# Altium schematic sheet Control Units.SchDoc
size A3
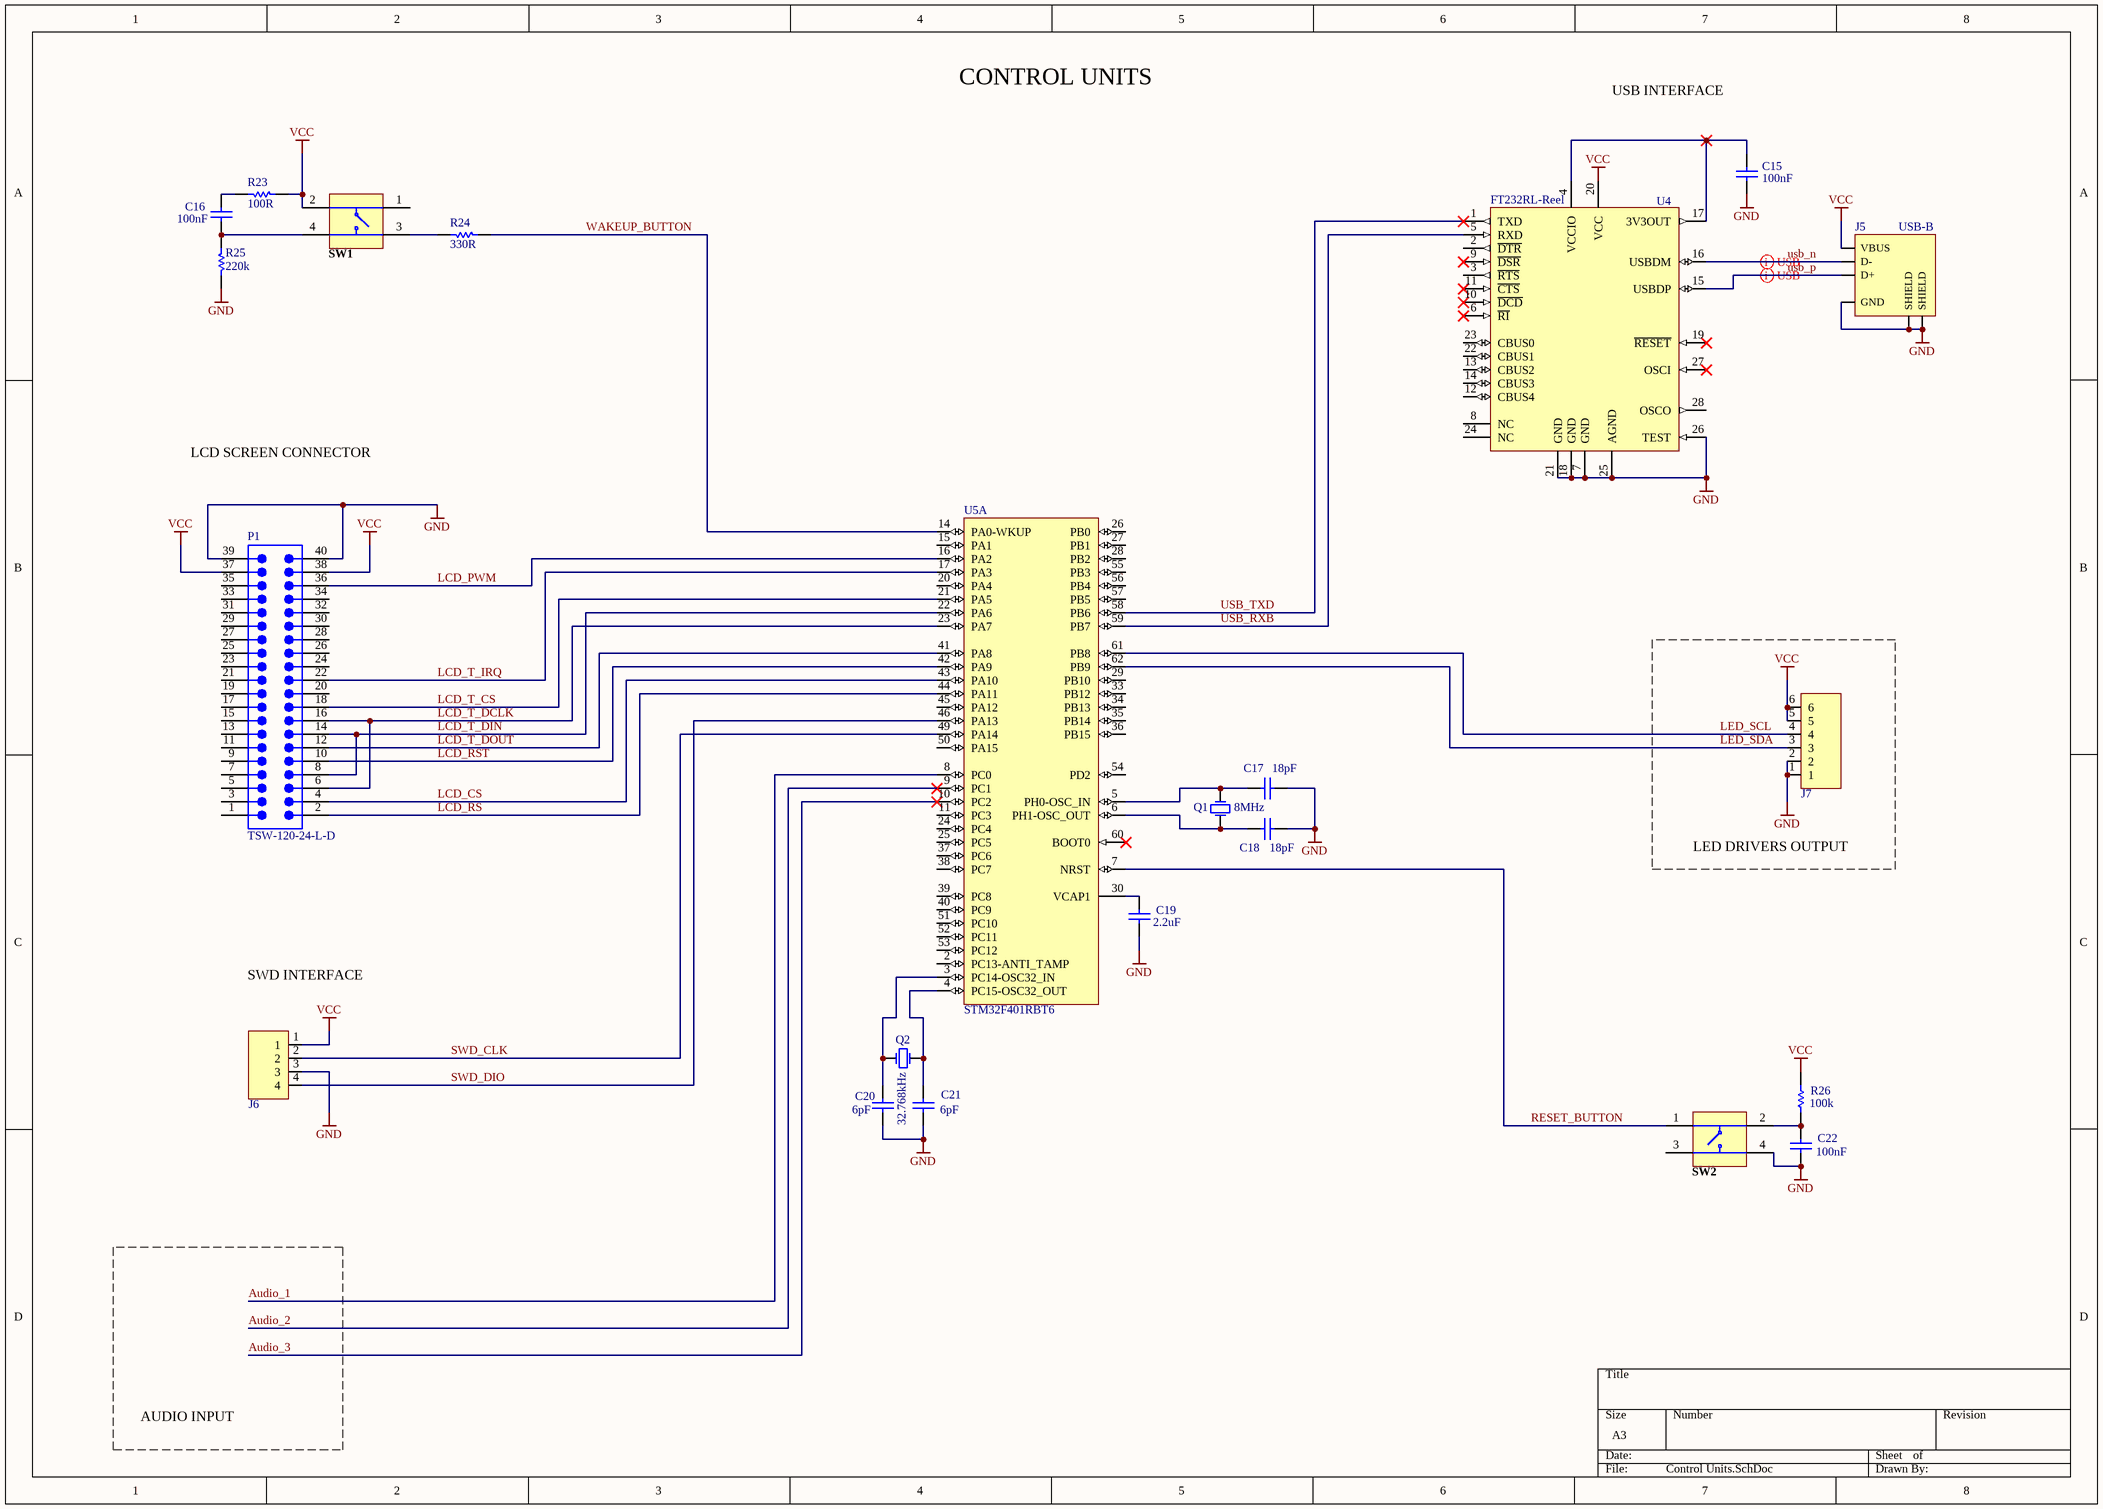
[diagram p0: Control Units.SchDoc]

## Parts
C15  value 100nF  [CAPC0603(1608)100_N]  (hidden comment: CAP 100nF 25V 0603(1608))
C16  value 100nF  [CAPC0603(1608)100_N]  (hidden comment: CAP 100nF 25V 0603(1608))
C17  value 18pF  [CAPC0603(1608)100_L]  (hidden comment: CAP 18pF 200V 0603(1608))
C18  value 18pF  [CAPC0603(1608)100_L]  (hidden comment: CAP 18pF 200V 0603(1608))
C19  value 2.2uF  [CAPC0603(1608)100_M]  (hidden comment: CAP 2.2uF 25V 0603(1608))
C20  value 6pF  [CAPC0603(1608)100_L]  (hidden comment: CAP 6pF 50V 0603(1608))
C21  value 6pF  [CAPC0603(1608)100_L]  (hidden comment: CAP 6pF 50V 0603(1608))
C22  value 100nF  [CAPC0603(1608)100_N]  (hidden comment: CAP 100nF 25V 0603(1608))
J5  USB-B  [UBS B]
J6  (no value)  [J_THT_HDR_1x4_R2.54-V]
J7  DS1021-1*40SF11  [J_THT_HDR_1x6_R2.54-V]  (value not drawn)
P1  TSW-120-24-L-D  [SMTC-TSW-120-24-X-D]
Q1  8MHz  [HC49SM]
Q2  32.768kHz  [PKG_CFPX-217]
R23  value 100R  [RESC0603(1608)_M]  (hidden comment: 100R 1% 0603(1608))
R24  value 330R  [RESC0603(1608)_L]  (hidden comment: 330R 1% 0603(1608))
R25  value 220k  [RESC0603(1608)_L]  (hidden comment: 220K 1% 0603(1608))
R26  value 100k  [RESC0603(1608)_N]  (hidden comment: 100K 5% 0603(1608))
SW1  TVCM01-038B  [JNFU-TVCM01-038B_V]  (value not drawn)
SW2  TVCM01-038B  [JNFU-TVCM01-038B_V]  (value not drawn)
U4  FT232RL-Reel  [SSOP-28_L]
U5  STM32F401RBT6  [STM-LQFP64_N]  (part A of 2)

## Blocks framed on the sheet
LED DRIVERS OUTPUT: J7

## Nets
GND: C15.2 C17.1 C18.1 C19.1 C20.2 C21.1 C22.2 J5.4(GND) J5.5(SHIELD) J5.6(SHIELD) J6.3 J7.1 J7.2 P1.39 P1.40 R25.1 SW2.4 U4.7(GND) U4.18(GND) U4.21(GND) U4.25(AGND) U4.26(TEST)
VCC: J5.1(VBUS) J6.1 J7.5 J7.6 P1.37 P1.38 R23.2 R26.2 SW1.2 U4.20(VCC)
Audio_1: U5.8(PC0)
Audio_2: U5.9(PC1)
Audio_3: U5.10(PC2)
LCD_CS: P1.4 U5.43(PA10)
LCD_PWM: P1.36 U5.16(PA2)
LCD_RS: P1.2 U5.44(PA11)
LCD_RST: P1.10 U5.42(PA9)
LCD_T_CS: P1.18 U5.21(PA5)
LCD_T_DCLK: P1.6 P1.16 U5.23(PA7)
LCD_T_DIN: P1.8 P1.14 U5.22(PA6)
LCD_T_DOUT: P1.12 U5.41(PA8)
LCD_T_IRQ: P1.22 U5.17(PA3)
LED_SCL: J7.4 U5.61(PB8)
LED_SDA: J7.3 U5.62(PB9)
RESET_BUTTON: SW2.1 U5.7(NRST)
SWD_CLK: J6.2 U5.49(PA14)
SWD_DIO: J6.4 U5.46(PA13)
usb_n: J5.3(D-) U4.16(USBDM)
usb_p: J5.2(D+) U4.15(USBDP)
USB_RXB: U4.5(RXD) U5.59(PB7)
USB_TXD: U4.1(TXD) U5.58(PB6)
WAKEUP_BUTTON: R24.1 U5.14(PA0-WKUP)
NetC15_1: C15.1 U4.4(VCCIO) U4.17(3V3OUT)
NetC16_1: C16.1 R23.1
NetC16_2: C16.2 R25.2 SW1.4
NetC17_2: C17.2 Q1.2(OSC2) U5.5(PH0-OSC_IN)
NetC18_2: C18.2 Q1.1(OSC1) U5.6(PH1-OSC_OUT)
NetC19_2: C19.2 U5.30(VCAP1)
NetC20_1: C20.1 Q2.2(OSC2) U5.3(PC14-OSC32_IN)
NetC21_2: C21.2 Q2.1(OSC1) U5.4(PC15-OSC32_OUT)
NetC22_1: C22.1 R26.1 SW2.2
NetR24_2: R24.2 SW1.3

Not connected (* = marked no-connect by the designer): P1 1 3 5 7 9 11 13 15 17 19 20 21 23 24 25 26 27 28 29 30 31 32 33 34 35; SW1 1; SW2 3; U4 2(~{DTR}) 3(~{RTS}) 6(~{RI})* 8(NC) 9(~{DSR})* 10(~{DCD})* 11(~{CTS})* 12(CBUS4) 13(CBUS2) 14(CBUS3) 19(~{RESET})* 22(CBUS1) 23(CBUS0) 24(NC) 27(OSCI)* 28(OSCO); U5 2(PC13-ANTI_TAMP) 11(PC3) 15(PA1) 20(PA4) 24(PC4) 25(PC5) 26(PB0) 27(PB1) 28(PB2) 29(PB10) 33(PB12) 34(PB13) 35(PB14) 36(PB15) 37(PC6) 38(PC7) 39(PC8) 40(PC9) 45(PA12) 50(PA15) 51(PC10) 52(PC11) 53(PC12) 54(PD2) 55(PB3) 56(PB4) 57(PB5) 60(BOOT0)*

## Layout directives
differential pair: usb_n, usb_p

## Notes on the sheet
- CONTROL UNITS
- USB INTERFACE
- LCD SCREEN CONNECTOR
- SWD INTERFACE
- AUDIO INPUT

## Library data of the parts
C15 C16 C22 = CMP-1035-02589-1: CAP 100nF 25V ±20% 0603 (1608 Metric) Thickness 1mm SMD; Case-EIA: 0603; Tolerance: Â±20%; Case-Metric: 1608; Max Thickness: 1 mm; Technology: SMT; Rated Voltage: 25 V
C17 C18 = CMP-1035-00761-1: CAP 18pF 200V ±5% 0603 (1608 Metric) Thickness 1mm SMD; Tolerance: Â±5%; Case-Metric: 1608; Case-EIA: 0603; Max Thickness: 1 mm; Technology: SMT; Rated Voltage: 200 V
C19 = CMP-1035-02767-1: CAP 2.2uF 25V ±10% 0603 (1608 Metric) Thickness 1mm SMD; Case-EIA: 0603; Tolerance: Â±10%; Case-Metric: 1608; Technology: SMT; Max Thickness: 1 mm; Rated Voltage: 25 V
C20 C21 = CMP-1035-00393-1: CAP 6pF 50V ±0.5pF 0603 (1608 Metric) Thickness 1mm SMD; Case-EIA: 0603; Tolerance: Â±0.5pF; Case-Metric: 1608; Technology: SMT; Max Thickness: 1 mm; Rated Voltage: 50 V
J5 = USB-B: Universal Serial Bus, Type B - 90° Receptacle (TH); Manufacturer: YAMAICHI ELECTRONICS; Component_author: Kajetan Śpionek; Value: USB-B port; HelpURL: http://www.glyn.com/data/glyn/media/doc/USB-B-001-RoHs.pdf; Supplier 1: Farnell; Supplier Part Number 1: 2112373
J6 = J_HDR_1x4: Złącze gold pin
J7 = J_HDR_1x6: Złącze gold pin; EMED_ID: J_HDR_1x6_THT_HDR_1x4_R2.54-V; Producent: CONNFLY; Author_FOOTPRINT: s.szwaczyk@emed.pl; Value: DS1021-1*40SF11; ComponentLink1Description: &Datasheet; ComponentLink1URL: http://www.tme.eu/pl/Document/347cfcc6d022658d2bea6c8b28397055/DS1021.pdf; ComponentLink2Description: &Nota Aplikacyjna; ComponentLink2URL: *; Distributor1: TME; Distributor1_ID: ZL201-40G; Distributor2: *; Distributor2_ID: *; HelpURL: http://www.tme.eu/pl/Document/347cfcc6d022658d2bea6c8b28397055/DS1021.pdf; Type: *; Current_RATED: *; Author_SYMBOL: s.szwaczyk@emed.pl; ESR: *; Power_RATED: *; Producent_ID: DS1021-1*40SF11; Series: *; Temperature_RATED: *; Tolerance: *; Voltage_AC: *; Voltage_DC: *; Voltage_RATED: *
P1 = CMP-1024-00454-1: Manufacturer: Samtec; Pitch: 2.54 mm; ComponentLink1Description: Manufacturer URL; ComponentLink3URL: http://www.samtec.com/documents/webfiles/cpdf/TSW-XXX-XX-XXX-X-XX-XXX-MKT.pdf; PackageVersion: DM, 8/1988; Orientation: Vertical; Mounting Technology: Through-hole; PackageDescription: .025[0.64] SQ. Post Terminal Strip Assembly; Temperature Range: -55 to 125 degC; ComponentLink1URL: http://www.samtec.com; PartNumber: TSW-120-24-L-D; DatasheetVersion: F-214; ComponentLink2URL: http://www.samtec.com/documents/webfiles/pdf/TSW_TH.PDF; ComponentLink3Description: Package Specification; RoHS: True; PackageReference: TSW-120-24-X-D; ComponentLink2Description: Datasheet
Q1 = Q_LFXTAL003151: Kwarc 8MHz, HC49SM; Value: 8MHz
Q2 = Q_CFPX-217: Kwarc 32.768kHz, CFPX-217; Value: 32.768kHz
R23 = CMP-1012-00397-1: 100R 0.1W 1% 0603 (1608 Metric)  SMD; Case-EIA: 0603; Case-Metric: 1608; Technology: SMT; Tolerance: 1 %; Power: 0.1 W
R24 = CMP-1012-00454-1: 330R 0.1W 1% 0603 (1608 Metric)  SMD; Case-Metric: 1608; Case-EIA: 0603; Tolerance: 1 %; Technology: SMT; Power: 0.1 W
R25 = CMP-1012-00772-1: 220K 0.1W 1% 0603 (1608 Metric)  SMD; Case-EIA: 0603; Case-Metric: 1608; Tolerance: 1 %; Technology: SMT; Power: 0.1 W
R26 = CMP-1012-00122-1: 100K 0.1W 5% 0603 (1608 Metric)  SMD; Case-EIA: 0603; Case-Metric: 1608; Tolerance: 5 %; Power: 0.1 W; Technology: SMT
SW1 SW2 = CMP-0224-00001-1: Switch, Push Button, 50 mA, 12V DC, SMD; Mechanical Life: 100,000 cycles; PackageReference: TVCM01-038B; Operating Temperature: -30 to 85 degC; ComponentLink1URL: http://www.jian-fu.com/; ComponentLink2Description: Datasheet; Mounting Technology: Suface Mount; Case Size: 4.5 x 4.5; ComponentLink1Description: Manufacturer URL; PartNumber: TVCM01-038B; ComponentLink2URL: http://www.jian-fu.com/product-61.html; PackageDescription: 4-Pin Surface Mount Switch, 4.5 x 4.5 mm Body
U4 = CMP-0078-00029-3: USB UART Asynchronous Serial Data Transfer Chip, 28-pin SSOP, Tape and Reel; Manufacturer: FTDI; PackageVersion: Mar-12; PackageReference: SSOP-28; ComponentLink2Description: Datasheet; DatasheetVersion: ver 2.10, Mar-2012; PackageDescription: 28-Pin Small Outline Package 0.65 mm Pitch; ComponentLink1Description: Manufacturer URL; RevisionNote: DatasheetVersion updated to 2.10 Mar-2012; PartNumber: FT232RL-Reel; ComponentLink1URL: http://www.ftdichip.com/; ComponentLink2URL: http://www.ftdichip.com/Support/Documents/DataSheets/ICs/DS_FT232R.pdf
U5 = CMP-0243-00094-2: ARM Cortex-M4 32-bit MCU+FPU, 105 DMIPS, 128 kB Flash, 64 kB Internal RAM, 48 I/Os, 64-pin LQFP, -40 to 85 degC, Tray; Manufacturer: STMicroelectronics; Internal RAM Size (kB): 64; FLASH Size (Prog) (kB): 128; Supply Voltage(Vcc) max (V): 3.6; I/Os (High Current): 48; Supply Voltage(Vcc) min (V): 1.8; Operating Frequency(F) (Processor speed) (MHz): 84; Core: ARM Cortex-M4; PackageDescription: 64-Pin Low Profile Quad Flat Package, 10 x 10 mm Body, 0.5 mm Pitch; Mounting Technology: Surface Mount; PackageVersion: Rev. 4, 06/2013; ComponentLink1URL: http://www.st.com/web/en/home.html; ComponentLink3Description: Package Specification; ComponentLink2Description: Datasheet; ComponentLink3URL: http://www.st.com/st-web-ui/static/active/en/resource/technical/document/datasheet/DM00037051.pdf; ComponentLink2URL: http://www.st.com/st-web-ui/static/active/en/resource/technical/document/data_brief/DM00071938.pdf; DatasheetVersion: Rev. 1; Packing: Tray; PackageReference: LQFP64; PartNumber: STM32F401RBT6; ComponentLink1Description: Manufacturer URL; PartId: 1